# EAGLE design LM358_VCO (EAGLE 6.6.0)
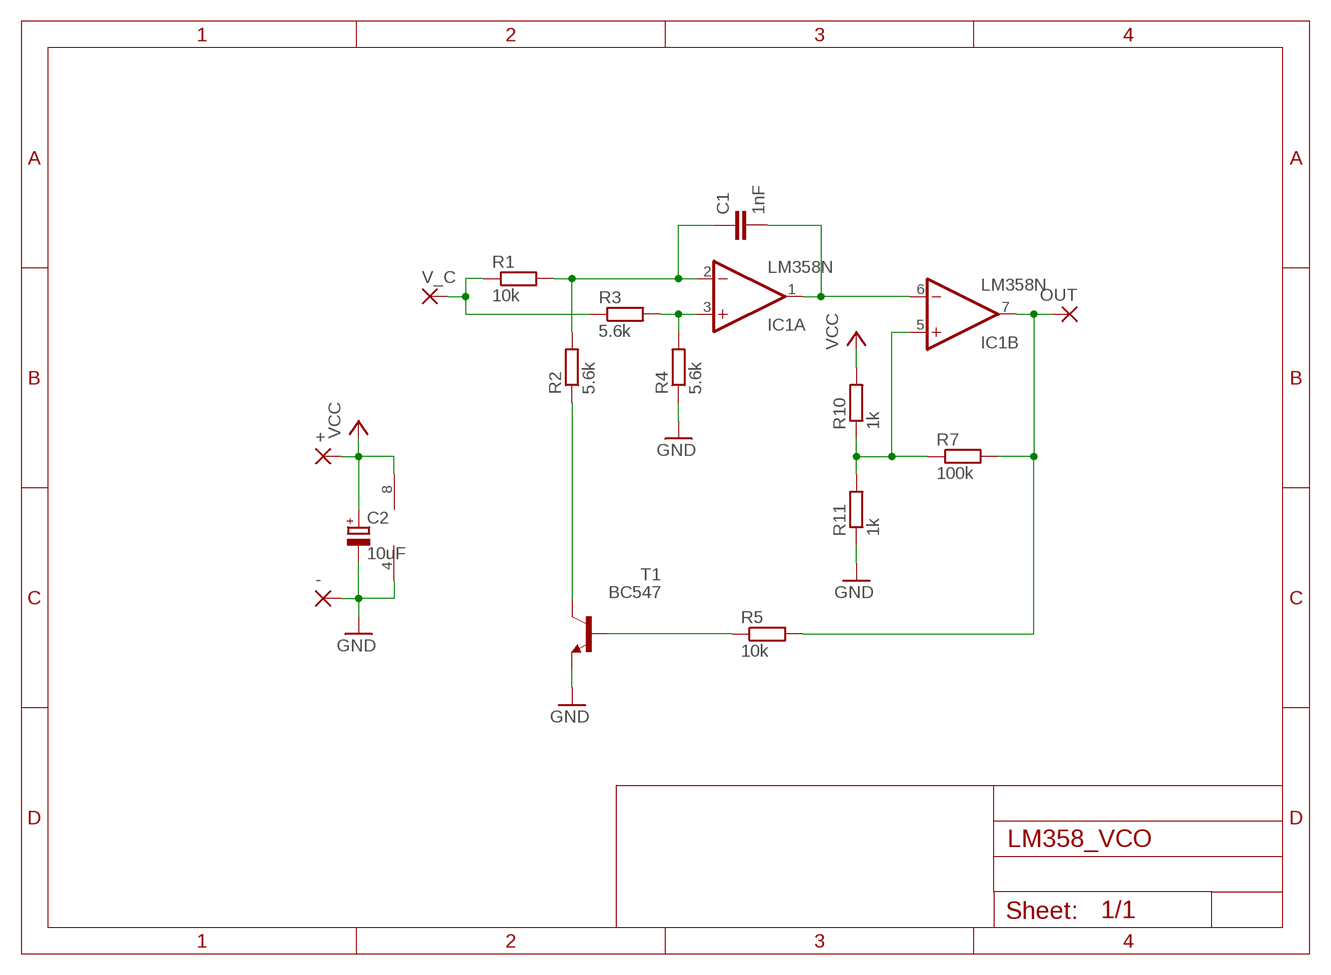
[diagram p0: schematic, sheet 1]

## Parts
+  1,6/0,8  [1,6/0,8]
-  1,6/0,8  [1,6/0,8]
C1  1nF  C-EU050-025X075  [C050-025X075]
C2  10uF  CPOL-EUB45181A  [B45181A]
IC1  LM358N  [DIL08]
OUT  1,6/0,8  [1,6/0,8]
R1  10k  R-EU_0204/7  [0204/7]
R2  5.6k  R-EU_0204/7  [0204/7]
R3  5.6k  R-EU_0204/7  [0204/7]
R4  5.6k  R-EU_0204/7  [0204/7]
R5  10k  R-EU_0204/7  [0204/7]
R7  100k  R-EU_0204/7  [0204/7]
R10  1k  R-EU_0204/7  [0204/7]
R11  1k  R-EU_0204/7  [0204/7]
T1  BC547  BC547-NPN-TO92-CBE  [TO92-CBE]
V_C  1,6/0,8  [1,6/0,8]

## Nets
GND: -.1(P) C2.- IC1.4(P:V-) R4.1 R11.1 T1.E
N$1: IC1.3(A:+IN) R3.2 R4.2
N$2: C1.1 IC1.2(A:-IN) R1.2 R2.2
N$3: R1.1 R3.1 V_C.1(P)
N$4: R2.1 T1.C
N$5: C1.2 IC1.1(A:OUT) IC1.6(B:-IN)
N$6: R5.1 T1.B
N$7: IC1.7(B:OUT) OUT.1(P) R5.2 R7.2
N$8: IC1.5(B:+IN) R7.1 R10.1 R11.2
VCC: +.1(P) C2.+ IC1.8(P:V+) R10.2

## Library data of the parts
+ - OUT V_C = wirepad:1,6/0,8: THROUGH-HOLE PAD
C1 = rcl:C-EU: CAPACITOR, European symbol
C2 = rcl:CPOL-EU: POLARIZED CAPACITOR, European symbol
IC1 = linear:LM358: OP AMP also LM158; LM258; LM2904 Source: http://cache.national.com/ds/LM/LM158.pdf
R1-R5 R7 R10 R11 = rcl:R-EU_: RESISTOR, European symbol
T1 = transistor:*-NPN-: NPN Transistror BF959 corrected 2008.03.06

## Board
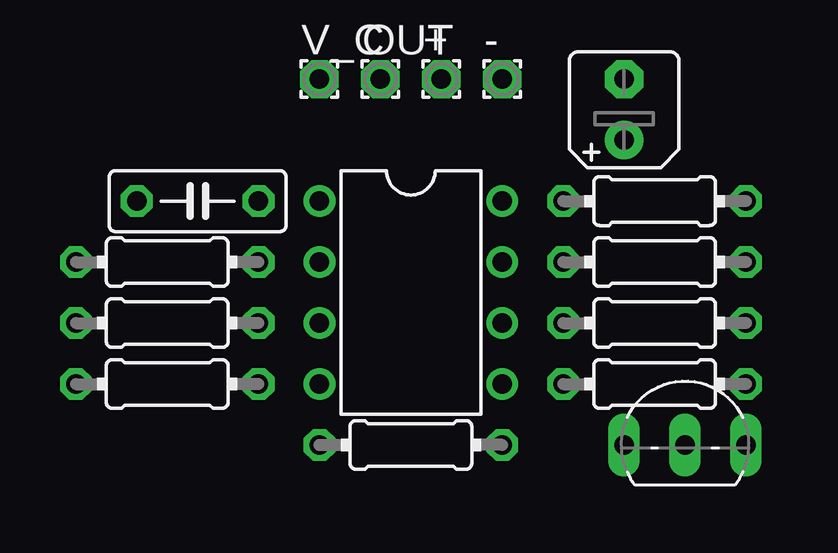
[diagram p1: board, top side]
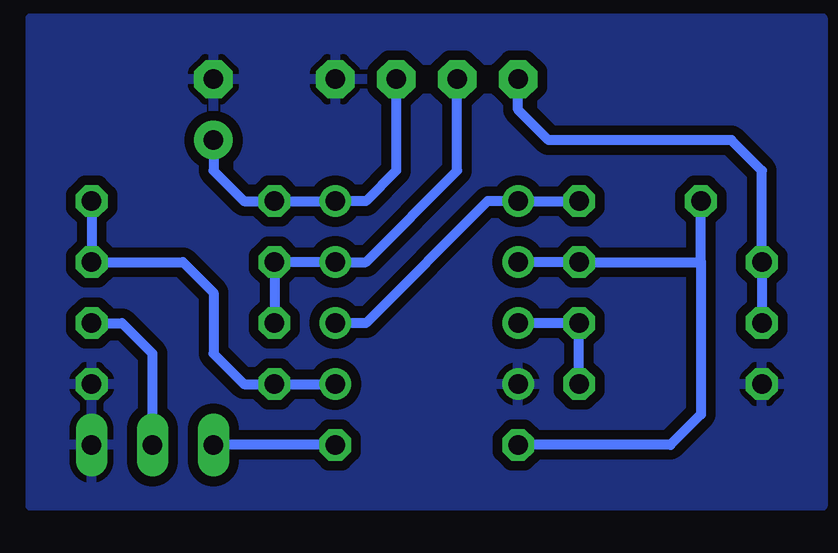
[diagram p2: board, bottom side, seen from below]

No outline drawn. Coordinates in mm, seen from the top.
Copper layers (1*16): Top 0.035mm / dielectric 1.5mm / Bottom 0.035mm
Design rules "default": minimum track width 10mil, minimum drill 24mil, track to track 8mil, track to pad 8mil, pad to pad 8mil, via to via 8mil, smd to smd 8mil, copper to edge 40mil, drill to drill 8mil, minimum pad ring 10mil, minimum via ring 8mil, stop-mask expansion 4mil, vias tented up to drill 0mil, thermal gap 10mil

### Footprints (pad centres in the part's own frame; a part is rotated, then mirrored left to right if it is on the bottom)
1,6/0,8 = drill 0.813 pad 1.6 octagon: 1 0,0
C050-025X075 = drill 0.813 octagon: 1 -2.54,0; 2 2.54,0
B45181A = drill 0.813 pad 1.6: + -1.27,0 | drill 0.813 pad 1.6 octagon: - 1.27,0
DIL08 = drill 0.813 pad 1.27: 1 -3.81,-3.81; 2 -1.27,-3.81; 3 1.27,-3.81; 4 3.81,-3.81; 5 3.81,3.81; 6 1.27,3.81; 7 -1.27,3.81; 8 -3.81,3.81
0204/7 = drill 0.813 octagon: 1 -3.81,0; 2 3.81,0
TO92-CBE = drill 0.813 long: B 0,0; C -2.54,0; E 2.54,0

### Placement (x,y rotation side)
+  17.78,17.78 0 top
-  20.32,17.78 0 top
C1  7.62,12.7 0 top
C2  25.4,16.51 90 top
IC1  16.51,8.89 270 top
OUT  15.24,17.78 0 top
R1  6.35,10.16 0 top
R2  16.51,2.54 180 top
R3  6.35,7.62 0 top
R4  6.35,5.08 0 top
R5  26.67,7.62 180 top
R7  26.67,10.16 180 top
R10  26.67,12.7 180 top
R11  26.67,5.08 180 top
T1  27.94,2.54 0 top
V_C  12.7,17.78 0 top

### Tracks (layer width: path | path; a pad name or v marks a point on that pad's centre or on a via)
GND
  pour Bottom (isolate 0.406): 0,0 33.02,0 33.02,20.32 0,20.32
N$1
  Bottom 0.406: IC1.3 R3.2 R4.2
N$2
  Bottom 0.406: 5.08,10.16 R1.2 IC1.2 | 5.08,10.16 5.08,3.81 6.35,2.54 R2.2 | 5.08,10.16 C1.1
N$3
  Bottom 0.406: R3.1 R1.1 2.54,13.97 3.81,15.24 11.43,15.24 12.7,16.51 V_C.1
N$4
  Bottom 0.406: R2.1 T1.C
N$5
  Bottom 0.406: C1.2 IC1.1 13.97,12.7 19.05,7.62 IC1.6
N$6
  Bottom 0.406: R5.1 29.21,7.62 27.94,6.35 T1.B
N$7
  Bottom 0.406: OUT.1 15.24,13.97 19.05,10.16 IC1.7 R7.2 R5.2
N$8
  Bottom 0.406: R10.1 R7.1 26.67,10.16 25.4,8.89 25.4,6.35 24.13,5.08 R11.2 IC1.5
VCC
  Bottom 0.406: +.1 17.78,13.97 19.05,12.7 IC1.8 R10.2 24.13,12.7 25.4,13.97 C2.+